# EAGLE design Jds-040-Usb-C-Single-Leds (EAGLE 9.6.2)
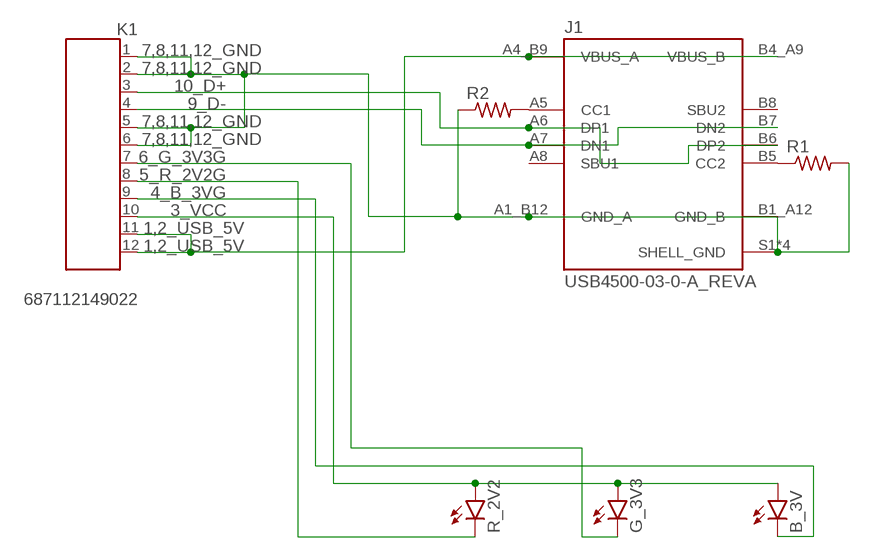
[diagram p0: schematic, sheet 1]

## Parts
B_3V  BEAGLEBONE_BLUE_LED0603  [BEAGLEBONE_BLUE_BEAGLEBONE_BLUE_LED-0603]
G_3V3  BEAGLEBONE_BLUE_LED0603  [BEAGLEBONE_BLUE_BEAGLEBONE_BLUE_LED-0603]
J1  USB4500-03-0-A_REVA  [GCT_USB4500-03-0-A_REVA]
K1  687112149022  [687112149022]
R1  5k1  RC0603JR-070RL  [RES_0603]
R2  5k1  RC0603JR-070RL  [RES_0603]
R_2V2  BEAGLEBONE_BLUE_LED0603  [BEAGLEBONE_BLUE_BEAGLEBONE_BLUE_LED-0603]

## Nets
1,2_USB_5V: J1.A4_B9(VBUS_A) J1.B4_A9(VBUS_B) K1.11 K1.12
3_VCC: B_3V.A G_3V3.A K1.10 R_2V2.A
4_B_3VG: B_3V.C K1.9
5_R_2V2G: K1.8 R_2V2.C
6_G_3V3G: G_3V3.C K1.7
7,8,11,12_GND: J1.A1_B12(GND_A) J1.B1_A12(GND_B) J1.S1(SHELL_GND) J1.S2(SHELL_GND) J1.S3(SHELL_GND) J1.S4(SHELL_GND) K1.1 K1.2 K1.5 K1.6 R1.2 R2.1
9_D-: J1.A7(DN1) J1.B7(DN2) K1.4
10_D+: J1.A6(DP1) J1.B6(DP2) K1.3
N$1: J1.B5(CC2) R1.1
N$2: J1.A5(CC1) R2.2
Unconnected: J1.A8(SBU1) J1.B8(SBU2)

## Library data of the parts
B_3V G_3V3 R_2V2 = BeagleBone_Blue_R3:BEAGLEBONE_BLUE_LED: LEDs Standard schematic elements and footprints for 5mm, 3mm, 1206, and 0603 sized LEDs. 5mm - Spark Fun Electronics SKU : COM-00529 (and others)
J1 = USB4500-03-0-A_REVA:USB4500-03-0-A_REVA: Check availability <https://pricing.snapeda.com/parts/USB4500-03-0-A/Global%20Connector%20Technology/view-part?ref=eda>; AVAILABILITY: In Stock; DESCRIPTION: USB-C (USB TYPE-C) USB 2.0 Receptacle Connector 24 (16+8 Dummy) Position Board Edge, Cutout; Surface Mount; Through Hole, Right Angle; MF: Global Connector Technology; MP: USB4500-03-0-A; PACKAGE: None; PRICE: None
K1 = FPC_Connectors_Flat_Flexible_Cable_rev15c:687112149022: WR-FPC 0.50mm SMT Horiz. Bot. Contact Hinge type WR-FPC 0.50mm 12 pins Hinge type SMT Horizontal Bottom Contact ;=>Code : Con_FPC_ZIF_0.50_6871xx149022_687112149022 <http://katalog.we-online.de/media/images/eican/Con_FPC_ZIF_0.50_687115149022_pf2.jpg> Details see: http://katalog.we-online.de/em/datasheet/6871xx149022.pdf Created 2014-10-08, Karrer Zheng 2014 (C) Wurth Elektronik
R1 R2 = Resistor_Capacitor:RC0603JR-070RL: RES SMD 0 OHM JUMPER 1/10W 0603 Manufacturer's datasheet <http://www.yageo.com/documents/recent/PYu-RC_Group_51_RoHS_L_10.pdf>; CREATED_BY: PCBLayout.com; DIGIKEY_PART_NUMBER: 311-0.0GRTR-ND; MANUFACTURER: Yageo; MPN: RC0603JR-070RL; PACKAGE: SMD 0603

## Board
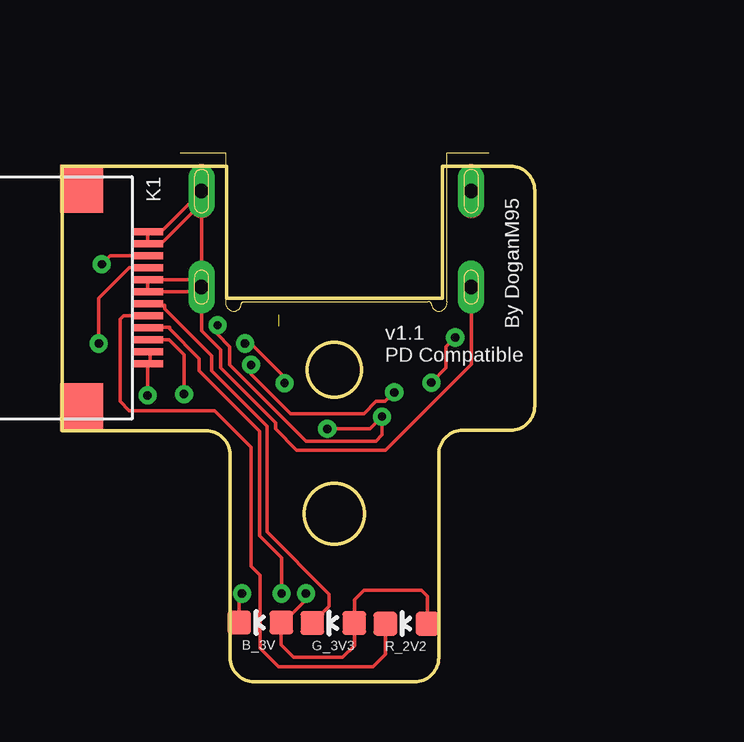
[diagram p1: board, top side]
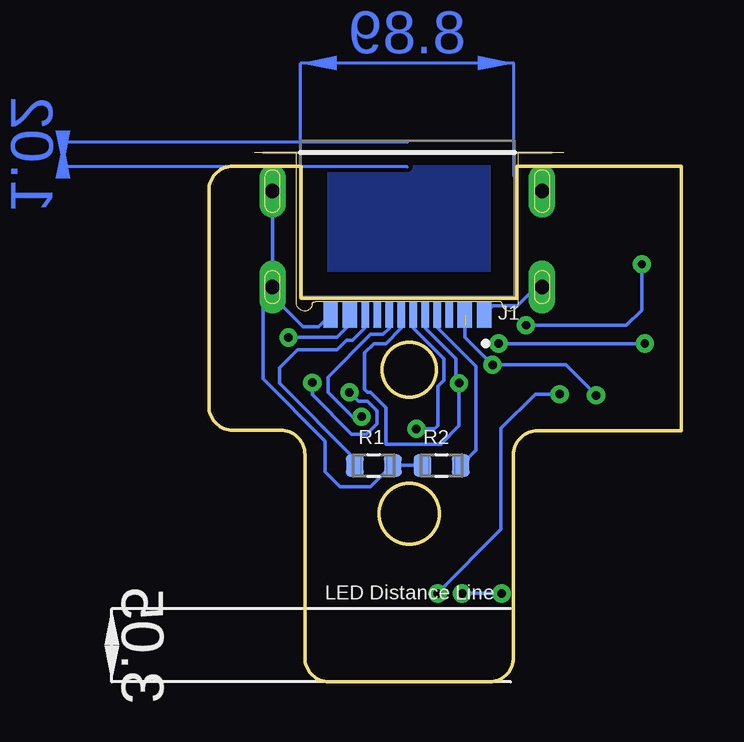
[diagram p2: board, bottom side, seen from below]

Size 19.7 x 21.48 mm. Coordinates in mm from the lower left corner, seen from the top.
Outline: 8,0 14.7,0 arc90 15.7,1 15.7,9.48 arc-90 16.7,10.48 18.7,10.48 arc90 19.7,11.48 19.7,20.48 arc90 18.7,21.48 15.85,21.48 15.85,15.98 6.85,15.98 6.85,21.48 0,21.48 0,10.46 6,10.46 arc-90 7,9.46 7,1 arc90 8,0
Outline: circle at 11.35,13 radius 1.12
Outline: circle at 11.35,7 radius 1.25
Copper layers (1*16): Top 0.035mm / dielectric 1.5mm / Bottom 0.035mm
Design rules "default *": minimum track width 6mil, minimum drill 0.35mm, track to track 6mil, track to pad 6mil, pad to pad 6mil, via to via 6mil, smd to smd 6mil, copper to edge 40mil, drill to drill 6mil, minimum pad ring 10mil, minimum via ring 8mil, stop-mask expansion 4mil, vias tented up to drill 20mil, thermal gap 10mil

### Footprints (pad centres in the part's own frame; a part is rotated, then mirrored left to right if it is on the bottom)
BEAGLEBONE_BLUE_BEAGLEBONE_BLUE_LED-0603 = smd 1 x 1: A 0,-0.877; C 0,0.877
GCT_USB4500-03-0-A_REVA = smd 0.6 x 1.1: A1_B12 -3.2,5.15; A4_B9 -2.4,5.15; B1_A12 3.2,5.15; B4_A9 2.4,5.15 | smd 0.3 x 1.1: A5 -1.25,5.15; A6 -0.25,5.15; A7 0.25,5.15; A8 1.25,5.15; B5 1.75,5.15; B6 0.75,5.15; B7 -0.75,5.15; B8 -1.75,5.15 | drill 0.6 pad 0.95 long: S1 -5.62,0; S4 5.62,0 | drill 0.6 pad 0.8 long: S2 5.62,4; S3 -5.62,4
687112149022 = smd 0.3 x 1.3: 1 -2.75,0; 2 -2.25,0; 3 -1.75,0; 4 -1.25,0; 5 -0.75,0; 6 -0.25,0; 7 0.25,0; 8 0.75,0; 9 1.25,0; 10 1.75,0; 11 2.25,0; 12 2.75,0 | smd 2 x 1.8: Z1 -4.55,-2.75; Z2 4.55,-2.75
RES_0603 = smd 0.74 x 0.93: 1 -0.795,0; 2 0.795,0

### Placement (x,y rotation side)
B_3V  8.26,2.47 90 top
G_3V3  11.3,2.44 90 top
J1  11.43,20.44 180 bottom
K1  3.56,16 270 top
R1  12.83,9.01 0 bottom
R2  10,9.01 0 bottom
R_2V2  14.35,2.42 90 top

### Tracks (layer width: path | path; a pad name or v marks a point on that pad's centre or on a via)
1,2_USB_5V  (via drill 0.35)  (1 unrouted)
  Top 0.152: K1.11 3.66,13.71 3.66,13.25 K1.12 v3.56,11.93 | v16.38,14.35 16,13.97 16,13.08 v15.39,12.46 | v13.84,12.06 13.46,11.68 13.08,11.68 12.57,11.17 9.53,11.17 7.87,12.82 v7.87,13.2
  Bottom 0.152: v3.56,11.93 4.83,13.2 v7.87,13.2 | v7.87,13.2 7.92,13.2 | 9.03,14.81 9.02,14.81 | v16.38,14.35 14.35,14.35 13.83,14.87 J1.B4_A9 | v15.39,12.46 15.39,11.96 13.75,10.32 13.14,10.32 12.7,10.76 12.7,11.3 13.08,11.68 13.46,11.68 v13.84,12.06 | J1.A4_B9 9.03,14.36 v7.87,13.2
3_VCC  (via drill 0.35)
  Top 0.152: K1.10 4.47,14.25 5.08,13.64 v5.08,11.98 | v10.16,3.68 10.16,3.42 9.2,2.47 B_3V.A 9.13,1.53 9.65,1.01 11.68,1.01 12.18,1.51 G_3V3.A 12.18,3.41 12.57,3.81 14.99,3.81 15.23,3.56 R_2V2.A
  Bottom 0.152: v5.08,11.98 6.1,11.98 7.52,10.56 7.52,6.35 10.16,3.7 v10.16,3.68
4_B_3VG  (via drill 0.35)
  Top 0.152: K1.9 3.66,14.78 4.47,14.78 4.47,14.7 5.71,13.46 5.71,12.95 8.23,10.43 8.23,6.09 9.14,5.18 v9.14,3.68 | v7.49,3.68 7.38,3.56 B_3V.C
  Bottom 0.152: v9.14,3.68 v7.49,3.68
5_R_2V2G
  Top 0.152: K1.8 2.55,15.25 2.41,15.11 2.41,11.68 2.79,11.3 6.35,11.3 7.87,9.77 7.87,4.82 8.26,4.44 8.26,1.39 9.02,0.63 12.95,0.63 13.47,1.15 R_2V2.C
6_G_3V3G
  Top 0.152: K1.7 3.66,15.69 4.27,15.69 4.27,15.54 6.22,13.58 6.22,12.95 8.53,10.64 8.53,6.24 11.12,3.65 11.12,3.14 G_3V3.C
7,8,11,12_GND
  Top 0.152: 3.66,16.3 K1.6 | 3.66,18.28 K1.2 | 3.66,18.74 K1.1 | 3.66,16.76 K1.5 | J1.S2 17.07,16.3 17.07,13.23 13.49,9.65 9.78,9.65 8.89,10.54 8.89,10.79 6.6,13.08 6.6,13.84 5.81,14.63 J1.S3 | 5.81,19.93 J1.S1 4.12,18.75 K1.1 | 5.81,19.93 J1.S3 | K1.1 K1.2 | K1.5 K1.6 | K1.5 5.5,16.75 J1.S3 | K1.6 5.62,16.25 J1.S3 | K1.2 4.12,18.25 5.81,19.93
  Bottom 0.152: R2.1 R1.2 12.06,9.01 12.95,8.12 14.22,8.12 14.86,8.76 14.86,10.03 17.45,12.62 17.45,15.86 17.42,16.07 J1.S2 | J1.S2 17.05,16.06 15.77,14.78 15.14,14.78 J1.B1_A12 | J1.S4 J1.S2 | J1.A1_B12 7.85,15.67 6.83,15.67 6.06,16.44 J1.S3
9_D-  (via drill 0.35)
  Top 0.152: K1.4 2.79,17.25 1.52,15.98 v1.52,14.09 | v7.62,14.09 7.87,14.09 9.27,12.7 v9.27,12.44
  Bottom 0.152: J1.B7 10.67,15.28 10.67,14.73 9.4,13.46 9.4,12.57 v9.27,12.44 9.27,10.66 10.03,9.9 12.32,9.9 12.32,11.43 12.95,12.06 13.08,12.06 13.21,12.19 13.21,13.71 12.83,14.09 12.32,14.09 11.68,14.73 J1.A7 | v7.62,14.09 v1.52,14.09
10_D+  (via drill 0.35)
  Top 0.152: K1.3 2,17.75 v1.65,17.39 | v6.48,14.85 6.48,14.47 6.99,13.97 6.99,13.2 10.16,10.03 13.08,10.03 13.34,10.28 v13.34,11.04 12.83,10.54 v11.05,10.54
  Bottom 0.152: v1.65,17.39 1.65,15.49 2.29,14.85 v6.48,14.85 | J1.B6 12.18,14.74 12.45,14.47 12.95,14.47 14.73,12.7 14.73,12.06 13.72,11.04 v13.34,11.04 | J1.A6 11.18,14.73 9.91,13.46 9.91,12.57 10.16,12.31 10.16,10.66 10.29,10.54 v11.05,10.54
CUTOUT_C
  pour Bottom: 6.99,21.46 15.88,21.46 15.88,16 6.99,16
N$1
  Bottom 0.152: J1.B5 13.21,15.26 13.21,14.73 13.72,14.22 13.97,14.22 14.35,13.84 16,13.84 16.76,13.08 16.76,12.44 13.62,9.3 R1.1
N$2
  Bottom 0.152: J1.A5 10.18,14.75 8.57,13.14 8.57,9.65 R2.2
(copper drawn outside any net)
  shapes: Bottom area x2

### Text on the board
tNames: By DoganM95 | v1.1 / PD Compatible
bNames: LED Distance Line